# EAGLE design Monitor_strip (EAGLE 7.7.0)
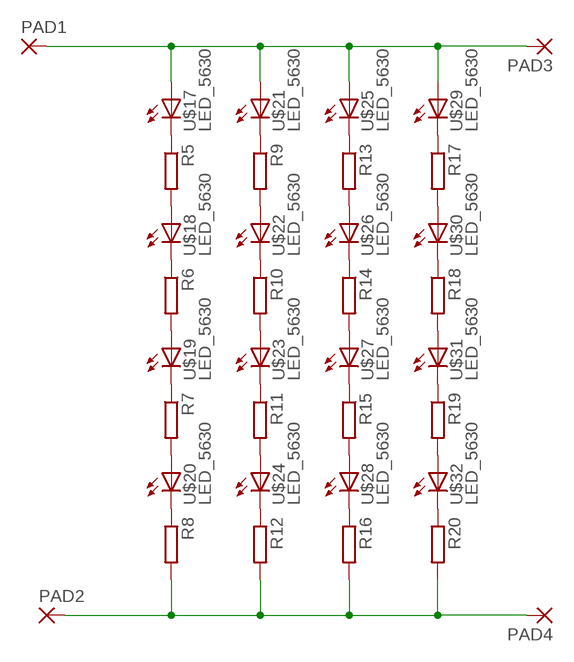
[diagram p0: schematic, sheet 1]

## Parts
PAD1  SMD2  [SMD1,27-2,54]
PAD2  SMD2  [SMD1,27-2,54]
PAD3  SMD2  [SMD1,27-2,54]
PAD4  SMD2  [SMD1,27-2,54]
R5  R_0805  [R0805]
R6  R_0805  [R0805]
R7  R_0805  [R0805]
R8  R_0805  [R0805]
R9  R_0805  [R0805]
R10  R_0805  [R0805]
R11  R_0805  [R0805]
R12  R_0805  [R0805]
R13  R_0805  [R0805]
R14  R_0805  [R0805]
R15  R_0805  [R0805]
R16  R_0805  [R0805]
R17  R_0805  [R0805]
R18  R_0805  [R0805]
R19  R_0805  [R0805]
R20  R_0805  [R0805]
U$17  LED_5630  [LED5730]
U$18  LED_5630  [LED5730]
U$19  LED_5630  [LED5730]
U$20  LED_5630  [LED5730]
U$21  LED_5630  [LED5730]
U$22  LED_5630  [LED5730]
U$23  LED_5630  [LED5730]
U$24  LED_5630  [LED5730]
U$25  LED_5630  [LED5730]
U$26  LED_5630  [LED5730]
U$27  LED_5630  [LED5730]
U$28  LED_5630  [LED5730]
U$29  LED_5630  [LED5730]
U$30  LED_5630  [LED5730]
U$31  LED_5630  [LED5730]
U$32  LED_5630  [LED5730]

## Nets
N$6: R5.1 U$17.C
N$9: R6.1 U$18.C
N$10: R7.1 U$19.C
N$15: R8.1 U$20.C
N$16: R6.2 U$19.A U$19.A1(A)
N$21: R7.2 U$20.A U$20.A1(A)
N$25: R5.2 U$18.A U$18.A1(A)
N$26: R9.1 U$21.C
N$27: R10.1 U$22.C
N$28: R11.1 U$23.C
N$29: R12.1 U$24.C
N$30: R10.2 U$23.A U$23.A1(A)
N$31: R11.2 U$24.A U$24.A1(A)
N$32: R9.2 U$22.A U$22.A1(A)
N$33: R13.1 U$25.C
N$34: R14.1 U$26.C
N$35: R15.1 U$27.C
N$36: R16.1 U$28.C
N$37: R14.2 U$27.A U$27.A1(A)
N$38: R15.2 U$28.A U$28.A1(A)
N$39: R13.2 U$26.A U$26.A1(A)
N$40: R17.1 U$29.C
N$41: R18.1 U$30.C
N$42: R19.1 U$31.C
N$43: R20.1 U$32.C
N$44: R18.2 U$31.A U$31.A1(A)
N$45: R19.2 U$32.A U$32.A1(A)
N$46: R17.2 U$30.A U$30.A1(A)
N$47: PAD1.1(P) PAD3.1(P) U$17.A U$17.A1(A) U$21.A U$21.A1(A) U$25.A U$25.A1(A) U$29.A U$29.A1(A)
N$48: PAD2.1(P) PAD4.1(P) R8.2 R12.2 R16.2 R20.2

## Library data of the parts
PAD1-PAD4 = wirepad:SMD2: SMD PAD
R5-R20 = Namenlos:R_
U$17-U$32 = Namenlos:LED_

## Board
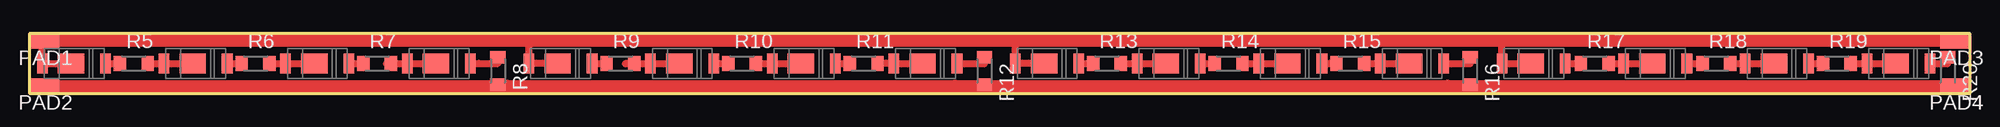
[diagram p1: board, top side]

Size 165.1 x 5.08 mm. Coordinates in mm from the lower left corner, seen from the top.
Outline: 0,5.08 0,0 165.1,0 165.1,5.08 0,5.08
Copper layers (1*16): Top 0.035mm / dielectric 1.5mm / Bottom 0.035mm
Design rules "default": minimum track width 10mil, minimum drill 24mil, track to track 8mil, track to pad 8mil, pad to pad 8mil, via to via 8mil, smd to smd 8mil, copper to edge 40mil, drill to drill 8mil, minimum pad ring 10mil, minimum via ring 8mil, stop-mask expansion 4mil, vias tented up to drill 0mil, thermal gap 10mil

### Footprints (pad centres in the part's own frame; a part is rotated, then mirrored left to right if it is on the bottom)
SMD1,27-2,54 = smd 1.27 x 2.54: 1 0,0
R0805 = smd 1.05 x 1.3: 1 -1.175,0; 2 1.175,0
LED5730 = smd 0.9 x 1.7: A -2.708,-0.014; C 2.672,-0.014 | smd 2.25 x 1.7: A1 -0.263,-0.014

### Placement (x,y rotation side)
PAD1  1.27,4.45 90 top
PAD2  1.27,0.64 90 top
PAD3  163.83,4.45 90 top
PAD4  163.83,0.64 90 top
R5  8.89,2.54 0 top
R6  19.24,2.54 0 top
R7  29.59,2.54 0 top
R8  39.86,1.91 270 top
R9  50.28,2.54 0 top
R10  60.63,2.54 0 top
R11  70.97,2.54 0 top
R12  81.25,1.91 270 top
R13  91.67,2.54 0 top
R14  102.02,2.54 0 top
R15  112.36,2.54 0 top
R16  122.56,1.91 270 top
R17  133.16,2.54 0 top
R18  143.51,2.54 0 top
R19  153.75,2.54 0 top
R20  163.19,1.91 270 top
U$17  3.81,2.54 0 top
U$18  14.16,2.54 0 top
U$19  24.5,2.54 0 top
U$20  34.85,2.54 0 top
U$21  45.2,2.54 0 top
U$22  55.55,2.54 0 top
U$23  65.89,2.54 0 top
U$24  76.24,2.54 0 top
U$25  86.59,2.54 0 top
U$26  96.94,2.54 0 top
U$27  107.28,2.54 0 top
U$28  117.63,2.54 0 top
U$29  127.98,2.54 0 top
U$30  138.33,2.54 0 top
U$31  148.68,2.54 0 top
U$32  159.02,2.54 0 top

### Tracks (layer width: path | path; a pad name or v marks a point on that pad's centre or on a via)
N$6
  Top 0.61: U$17.C R5.1
N$9
  Top 0.61: U$18.C 17.02,2.54 R6.1
N$10
  Top 0.61: U$19.C 27.55,2.54 R7.1
N$15
  Top 0.61: U$20.C 38.23,2.54 39.86,2.54 R8.1
N$16
  Top 0.61: R6.2 20.23,2.53 U$19.A U$19.A1
N$21
  Top 0.61: R7.2 30.39,2.53 U$20.A U$20.A1
N$25
  Top 0.61: R5.2 10.06,2.53 U$18.A U$18.A1
N$26
  Top 0.61: U$21.C 48.25,2.54 R9.1
N$27
  Top 0.61: U$22.C 58.55,2.54 R10.1
N$28
  Top 0.61: U$23.C 68.67,2.53 R11.1
N$29
  Top 0.61: U$24.C 81.25,2.53 R12.1
N$30
  Top 0.61: R10.2 62.06,2.54 U$23.A U$23.A1
N$31
  Top 0.61: R11.2 72.39,2.54 72.39,2.53 U$24.A U$24.A1
N$32
  Top 0.61: R9.2 50.7,2.53 U$22.A U$22.A1
N$33
  Top 0.61: U$25.C 90.3,2.54 R13.1
N$34
  Top 0.61: U$26.C 100.46,2.54 R14.1
N$35
  Top 0.61: U$27.C 110.62,2.54 R15.1
N$36
  Top 0.61: U$28.C 122.56,2.53 R16.1
N$37
  Top 0.61: R14.2 104.05,2.53 U$27.A U$27.A1
N$38
  Top 0.61: R15.2 114.2,2.53 U$28.A U$28.A1
N$39
  Top 0.61: R13.2 95.16,2.53 | U$26.A 95.16,2.53 | 95.16,2.53 U$26.A1
N$40
  Top 0.61: U$29.C 130.94,2.54 R17.1
N$41
  Top 0.61: U$30.C 141.1,2.54 R18.1
N$42
  Top 0.61: U$31.C 151.26,2.54 R19.1
N$43
  Top 0.61: U$32.C 163.19,2.53 R20.1
N$44
  Top 0.61: R18.2 144.69,2.53 U$31.A U$31.A1
N$45
  Top 0.61: R19.2 154.84,2.53 U$32.A U$32.A1
N$46
  Top 0.61: R17.2 134.53,2.53 U$30.A U$30.A1
N$47
  Top 0.61: PAD1.1 1.1,4.45 U$17.A U$17.A1 | 42.49,4.45 U$21.A U$21.A1 | 83.88,4.45 U$25.A U$25.A1 | 125.27,4.45 U$29.A U$29.A1
  Top 1.016: PAD3.1 125.27,4.45 83.88,4.45 42.49,4.45 PAD1.1
N$48
  Top 0.61: R8.2 40.55,0.64 40.64,0.64 | R12.2 78.74,0.73 78.74,0.64 | R16.2 120.65,0.73 120.65,0.64 | R20.2 161.29,0.73 PAD4.1
  Top 1.016: PAD2.1 40.64,0.64 78.74,0.64 120.65,0.64 PAD4.1